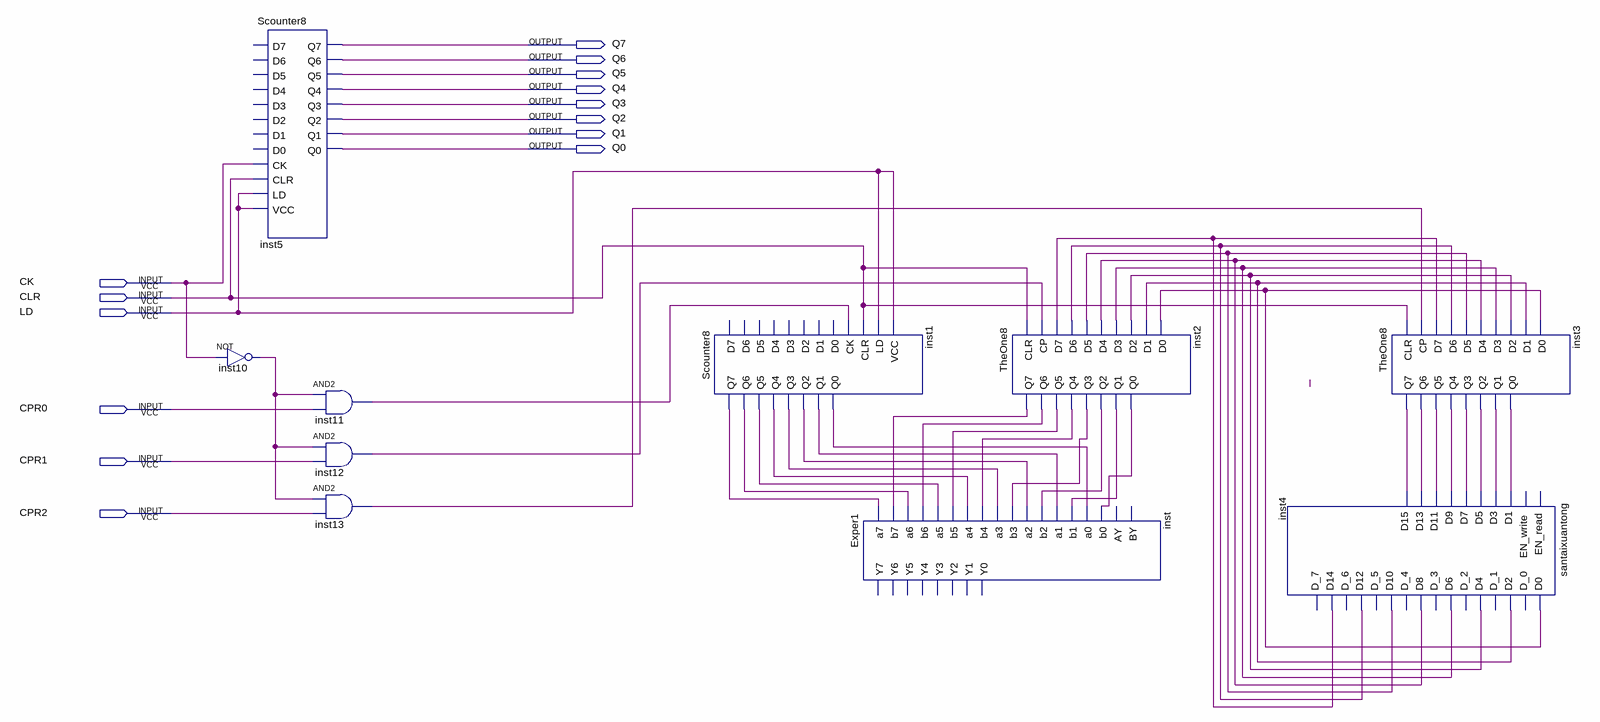
[diagram p0: schematic sheet]
// Quartus schematic fangcunxitong.bdf as structural Verilog: 10 symbols, 14 pins
module fangcunxitong (
  input  CK,
  input  CLR,
  input  LD,
  input  CPR0,
  input  CPR1,
  input  CPR2,
  output Q7,
  output Q6,
  output Q5,
  output Q4,
  output Q3,
  output Q2,
  output Q1,
  output Q0
);

  wire inst1_q0, inst1_q1, inst1_q2, inst1_q3, inst1_q4, inst1_q5, inst1_q6, inst1_q7, inst2_q0, inst2_q1,
       inst2_q2, inst2_q3, inst2_q4, inst2_q5, inst2_q6, inst2_q7, inst3_q0, inst3_q1, inst3_q2, inst3_q3,
       inst3_q4, inst3_q5, inst3_q6, inst3_q7, inst4_d0, inst4_d2, inst4_d4, inst4_d6, inst4_d8, inst4_d10,
       inst4_d12, inst4_d14, inst10_out, inst11_out, inst12_out, inst13_out;

  not inst10 (inst10_out, CK);
  Scounter8 inst5 (
    .CK(CK), .CLR(CLR), .LD(LD), .VCC(LD), .Q7(Q7), .Q6(Q6), .Q5(Q5), .Q4(Q4), .Q3(Q3), .Q2(Q2), .Q1(Q1),
    .Q0(Q0));  // open: D7, D6, D5, D4, D3, D2, D1, D0
  and inst11 (inst11_out, inst10_out, CPR0);
  and inst12 (inst12_out, inst10_out, CPR1);
  and inst13 (inst13_out, inst10_out, CPR2);
  Scounter8 inst1 (
    .CK(inst11_out), .CLR(CLR), .LD(LD), .VCC(LD), .Q7(inst1_q7), .Q6(inst1_q6), .Q5(inst1_q5),
    .Q4(inst1_q4), .Q3(inst1_q3), .Q2(inst1_q2), .Q1(inst1_q1), .Q0(inst1_q0));  // open: D7, D6, D5, D4, D3, D2, D1, D0
  Exper1 inst (
    .a7(inst1_q7), .b7(inst2_q7), .a6(inst1_q6), .b6(inst2_q6), .a5(inst1_q5), .b5(inst2_q5), .a4(inst1_q4),
    .b4(inst2_q4), .a3(inst1_q3), .b3(inst2_q3), .a2(inst1_q2), .b2(inst2_q2), .a1(inst1_q1), .b1(inst2_q1),
    .a0(inst1_q0), .b0(inst2_q0));  // open: AY, BY, Y7, Y6, Y5, Y4, Y3, Y2, Y1, Y0
  TheOne8 inst2 (
    .CLR(CLR), .CP(inst12_out), .D7(inst4_d14), .D6(inst4_d12), .D5(inst4_d10), .D4(inst4_d8), .D3(inst4_d6),
    .D2(inst4_d4), .D1(inst4_d2), .D0(inst4_d0), .Q7(inst2_q7), .Q6(inst2_q6), .Q5(inst2_q5), .Q4(inst2_q4),
    .Q3(inst2_q3), .Q2(inst2_q2), .Q1(inst2_q1), .Q0(inst2_q0));
  santaixuantong inst4 (
    .D1(inst3_q0), .D3(inst3_q1), .D5(inst3_q2), .D7(inst3_q3), .D9(inst3_q4), .D11(inst3_q5),
    .D13(inst3_q6), .D15(inst3_q7), .D0(inst4_d0), .D2(inst4_d2), .D4(inst4_d4), .D6(inst4_d6),
    .D8(inst4_d8), .D10(inst4_d10), .D12(inst4_d12), .D14(inst4_d14));  // open: EN_read, EN_write, D_0, D_1, D_2, D_3, D_4, D_5, D_6, D_7
  TheOne8 inst3 (
    .CLR(CLR), .CP(inst13_out), .D7(inst4_d14), .D6(inst4_d12), .D5(inst4_d10), .D4(inst4_d8), .D3(inst4_d6),
    .D2(inst4_d4), .D1(inst4_d2), .D0(inst4_d0), .Q7(inst3_q7), .Q6(inst3_q6), .Q5(inst3_q5), .Q4(inst3_q4),
    .Q3(inst3_q3), .Q2(inst3_q2), .Q1(inst3_q1), .Q0(inst3_q0));
endmodule
